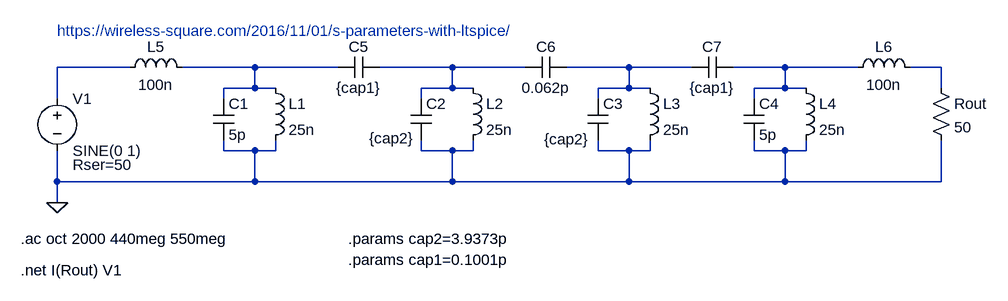
[diagram p0: schematic sparam_example.asc]
sparam_example.asc, the LTspice schematic file:
Version 4
SHEET 1 1416 680
WIRE -768 176 -880 176
WIRE -576 176 -688 176
WIRE -448 176 -576 176
WIRE -272 176 -384 176
WIRE -160 176 -272 176
WIRE 0 176 -96 176
WIRE 96 176 0 176
WIRE 240 176 160 176
WIRE 352 176 240 176
WIRE 480 176 432 176
WIRE -576 208 -576 176
WIRE -576 208 -624 208
WIRE -544 208 -576 208
WIRE -272 208 -272 176
WIRE -272 208 -320 208
WIRE -240 208 -272 208
WIRE 0 208 0 176
WIRE 0 208 -48 208
WIRE 32 208 0 208
WIRE 240 208 240 176
WIRE 240 208 192 208
WIRE 272 208 240 208
WIRE 480 208 480 176
WIRE -880 224 -880 176
WIRE -624 224 -624 208
WIRE -320 224 -320 208
WIRE -48 224 -48 208
WIRE 192 224 192 208
WIRE -624 304 -624 288
WIRE -576 304 -624 304
WIRE -544 304 -544 288
WIRE -544 304 -576 304
WIRE -320 304 -320 288
WIRE -272 304 -320 304
WIRE -240 304 -240 288
WIRE -240 304 -272 304
WIRE -48 304 -48 288
WIRE 0 304 -48 304
WIRE 32 304 32 288
WIRE 32 304 0 304
WIRE 192 304 192 288
WIRE 240 304 192 304
WIRE 272 304 272 288
WIRE 272 304 240 304
WIRE -880 352 -880 304
WIRE -576 352 -576 304
WIRE -576 352 -880 352
WIRE -272 352 -272 304
WIRE -272 352 -576 352
WIRE 0 352 0 304
WIRE 0 352 -272 352
WIRE 240 352 240 304
WIRE 240 352 0 352
WIRE 480 352 480 288
WIRE 480 352 240 352
WIRE -880 384 -880 352
FLAG -880 384 0
SYMBOL voltage -880 208 R0
WINDOW 39 24 118 Left 2
SYMATTR InstName V1
SYMATTR Value SINE(0 1)
SYMATTR SpiceLine Rser=50
SYMBOL ind -560 192 R0
SYMATTR InstName L1
SYMATTR Value 25n
SYMBOL ind -256 192 R0
SYMATTR InstName L2
SYMATTR Value 25n
SYMBOL ind 16 192 R0
SYMATTR InstName L3
SYMATTR Value 25n
SYMBOL ind 256 192 R0
SYMATTR InstName L4
SYMATTR Value 25n
SYMBOL ind -784 192 R270
WINDOW 0 32 56 VTop 2
WINDOW 3 5 56 VBottom 2
SYMATTR InstName L5
SYMATTR Value 100n
SYMBOL ind 336 192 R270
WINDOW 0 32 56 VTop 2
WINDOW 3 5 56 VBottom 2
SYMATTR InstName L6
SYMATTR Value 100n
SYMBOL cap -640 224 R0
SYMATTR InstName C1
SYMATTR Value 5p
SYMBOL cap -336 224 R0
WINDOW 3 -64 61 Left 2
SYMATTR InstName C2
SYMATTR Value {cap2}
SYMBOL cap -64 224 R0
WINDOW 3 -67 63 Left 2
SYMATTR InstName C3
SYMATTR Value {cap2}
SYMBOL cap 176 224 R0
SYMATTR InstName C4
SYMATTR Value 5p
SYMBOL cap -384 160 R90
WINDOW 0 0 32 VBottom 2
WINDOW 3 32 32 VTop 2
SYMATTR InstName C5
SYMATTR Value {cap1}
SYMBOL cap -96 160 R90
WINDOW 0 0 32 VBottom 2
WINDOW 3 32 32 VTop 2
SYMATTR InstName C6
SYMATTR Value 0.062p
SYMBOL cap 160 160 R90
WINDOW 0 0 32 VBottom 2
WINDOW 3 32 32 VTop 2
SYMATTR InstName C7
SYMATTR Value {cap1}
SYMBOL res 464 192 R0
SYMATTR InstName Rout
SYMATTR Value 50
TEXT -936 440 Left 2 !.ac oct 2000 440meg 550meg
TEXT -936 488 Left 2 !.net I(Rout) V1
TEXT -432 440 Left 2 !.params cap2=3.9373p
TEXT -432 472 Left 2 !.params cap1=0.1001p
TEXT -880 120 Left 2 ;https://wireless-square.com/2016/11/01/s-parameters-with-ltspice/

The netlist it stands for:
* sparam_example.asc
V1 N001 0 SINE(0 1) Rser=50
L1 N002 0 25n
L2 N003 0 25n
L3 N004 0 25n
L4 N005 0 25n
L5 N001 N002 100n
L6 N005 N006 100n
C1 N002 0 5p
C2 N003 0 {cap2}
C3 N004 0 {cap2}
C4 N005 0 5p
C5 N003 N002 {cap1}
C6 N004 N003 0.062p
C7 N005 N004 {cap1}
Rout N006 0 50
.ac oct 2000 440meg 550meg
.net I(Rout) V1
.params cap2=3.9373p
.params cap1=0.1001p
* https://wireless-square.com/2016/11/01/s-parameters-with-ltspice/
.backanno
.end